# Altium schematic sheet interface.SchDoc
size A4
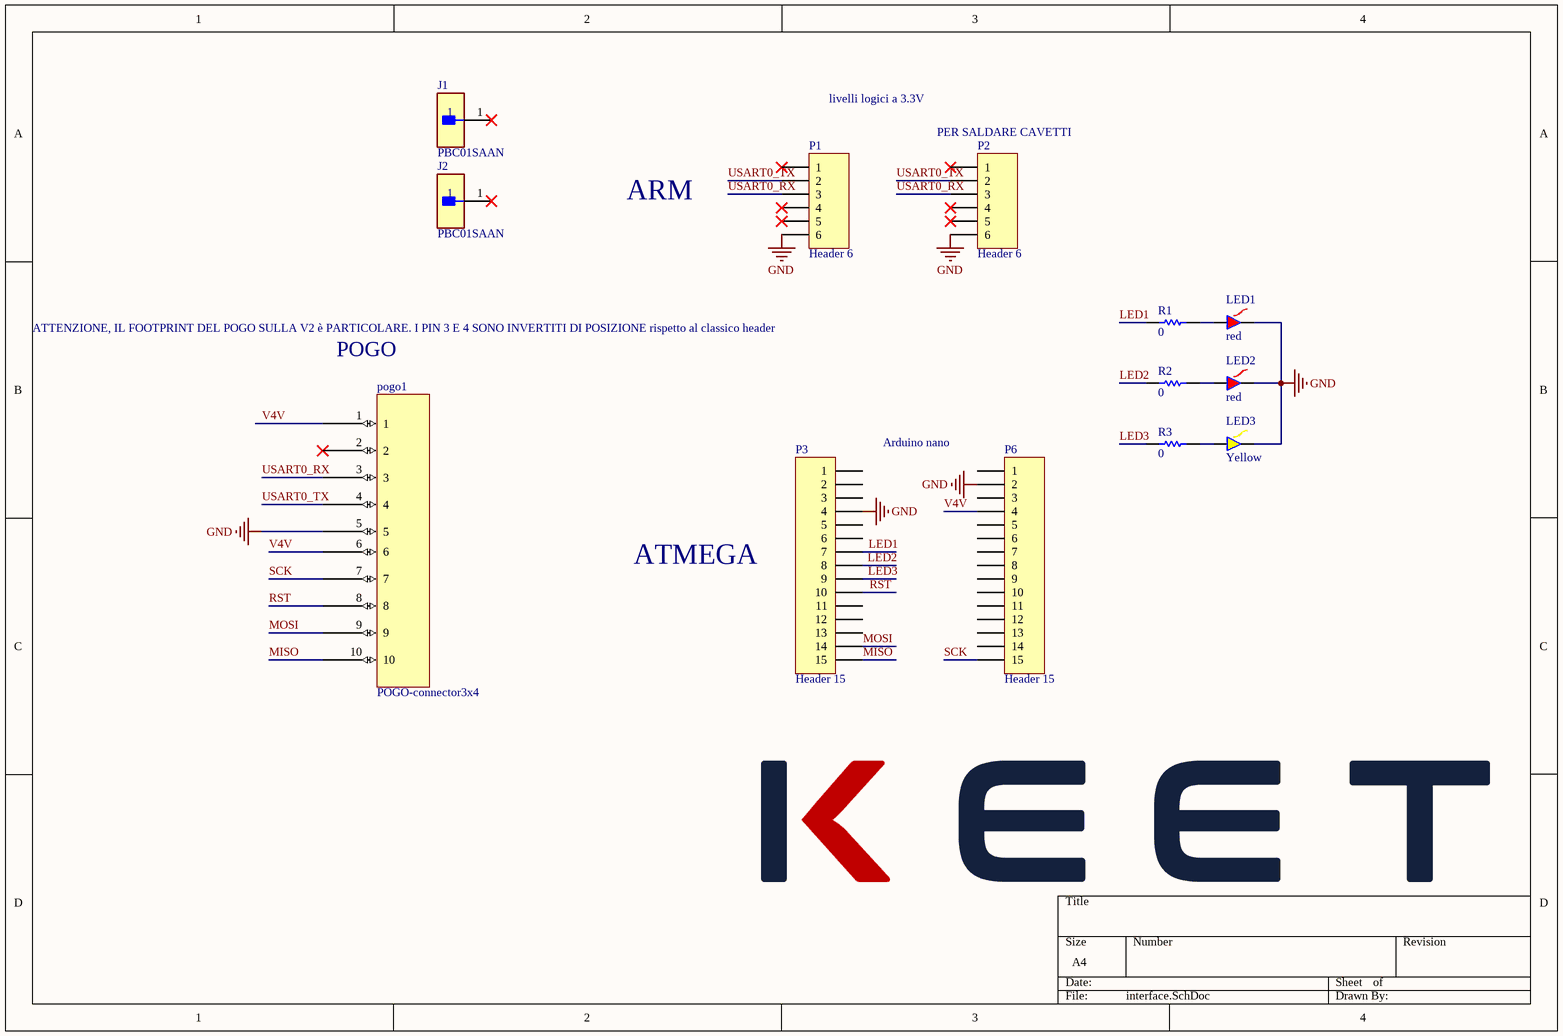
[diagram p0: interface.SchDoc]

## Parts
J1  PBC01SAAN  [FP-PBC01SAAN-MFG]
J2  PBC01SAAN  [FP-PBC01SAAN-MFG]
LED1  red  [CAC-0P80X160-2N_ver2]
LED2  red  [CAC-0P80X160-2N_ver2]
LED3  Yellow  [CAC-0P80X160-2N_ver2]
P1  Header 6  [HDR1X6]
P2  Header 6  [HDR1X6]
P3  Header 15  [HDR1X15]
P6  Header 15  [HDR1X15]
pogo1  POGO-connector3x4  [POGO_fisico]
R1  0  [RESC1608X04N]
R2  0  [RESC1608X04N]
R3  0  [RESC1608X04N]

## Nets
GND: LED1.1(K) LED2.1(K) LED3.1(K) P1.6 P2.6 P3.4 P6.2 pogo1.5
LED1: P3.7 R1.1
LED2: P3.8 R2.1
LED3: P3.9 R3.1
MISO: P3.15 pogo1.10
MOSI: P3.14 pogo1.9
RST: P3.10 pogo1.8
SCK: P6.15 pogo1.7
USART0_RX: P1.3 P2.3 pogo1.3
USART0_TX: P1.2 P2.2 pogo1.4
V4V: P6.4 pogo1.1 pogo1.6
NetLED1_2: LED1.2(A) R1.2
NetLED2_2: LED2.2(A) R2.2
NetLED3_2: LED3.2(A) R3.2

Not connected (* = marked no-connect by the designer): J1 1*; J2 1*; P1 1* 4* 5*; P2 1* 4* 5*; P3 1 2 3 5 6 11 12 13; P6 1 3 5 6 7 8 9 10 11 12 13 14; pogo1 2*

## Notes on the sheet
- livelli logici a 3.3V
- (near P2) PER SALDARE CAVETTI
- ARM
- ATTENZIONE, IL FOOTPRINT DEL POGO SULLA V2 è PARTICOLARE. I PIN 3 E 4 SONO INVERTITI DI POSIZIONE rispetto al classico header
- POGO
- Arduino nano
- ATMEGA

## Library data of the parts
J1 J2 = CMP-25680-000032-1: CONN HEADER VERT 1POS; Number of Positions: 1; Connector Type: Male Pin; Gender: Male; Pitch: 2.54mm; Contact Material: Bronze; Mount: Through Hole; Length: 2.54mm; Height: 2.54mm; Lead Free: Lead Free; Number of Rows: 1; Contact Plating: Gold; Number of Contacts: 1; Housing Material: Plastic; Termination: Solder; Package Quantity: 1; Packaging: Bulk; Color: Black; Contact Mating Length: 0.23inch; Housing Color: Black; Width: 2.54mm
LED1 LED2 = HSMS-C190: AVAGO TECHNOLOGIES - HSMS-C190 - LED, RED, 10MCD, 626NM; Manufacturer: Broadcom Avago; Lens Color: White; Forward Voltage: 2.1V; Viewing Angle: 170°; Lens Style: Diffused,Colorless,Rectangular; Forward Current: 20mA; Lens Transparency: Diffused; Power Dissipation: 52mW; Number of Elements: 1; Reverse Voltage: 5V; Supplier 1: Mouser; Manufacturer Part Number: HSMS-C190; RoHS: Yes; Category: LEDs; Stock 1: 51818; Pricing 1: 1=0,41000, 10=0,28800, 50=0,28800, 100=0,12800, 1000=0,09400, 10000=0,06400 (USD); Mount: Surface Mount; Case/Package: 0603; Number of Pins: 2; Color: Red; Case Code (Metric): 1608; Case Code (Imperial): 0603; Min Operating Temperature: -40°C; Max Operating Temperature: 85°C; Luminous Intensity: 10mcd; Packaging: Tape and Reel; Wavelength: 626nm; Dominant Wavelength: 626nm; Test Current: 20mA; Package Quantity: 4000; Illumination Color: Red; Power Rating: 52mW; Number of LEDs: 1; Series: -; Length: 1.6mm; Width: 0.8mm; Height: 0.8mm; Depth: 0.8mm; Radiation Hardening: No; REACH SVHC: No SVHC; Lead Free: Lead Free; RoHS Compliant: Yes; Supplier Part Number 1: 630-HSMS-C190
LED3 = HSMY-C190: LED, YELLOW, 8MCD, 586NM; LED Colour:Yellow; Bulb Size:-; Wavelength Typ:586nm; Forward Voltage:2.1V; Forward Current If:20mA; Luminous Intensity:8mcd; LED Mounting:SMD; Lens Shape:Rectangular; Viewing Angle:170 ; Packaging:Cut Tape;;RoHS Compliant: Yes; Manufacturer: Broadcom Avago; Lens Color: White; Number of Terminals/Pins: 2; Lens Style: Rectangular,Untinted,Diffused,Colorless; Forward Voltage: 2.1V; Viewing Angle: 170°; Forward Current: 20mA; Lens Transparency: Diffused; Power Dissipation: 52mW; Number of Elements: 1; Reverse Voltage: 5V; Supplier 1: Mouser; Manufacturer Part Number: HSMY-C190; RoHS: Yes; Category: LEDs; Stock 1: 44023; Pricing 1: 1=0,41000, 10=0,28800, 50=0,28800, 100=0,12800, 1000=0,09400, 10000=0,06400 (USD); Mount: Surface Mount; Case/Package: 0603; Number of Pins: 2; Color: Yellow; Case Code (Metric): 1608; Case Code (Imperial): 0603; Shape: Rectangular; Contact Plating: Gold; Min Operating Temperature: -40°C; Max Operating Temperature: 85°C; Luminous Intensity: 8mcd; Wavelength: 586nm; Packaging: Tape and Reel; Dominant Wavelength: 586nm; Test Current: 20mA; Package Quantity: 1; Illumination Color: Yellow; Power Rating: 52mW; Max Power Dissipation: 52mW; Number of LEDs: 1; Series: -; Length: 1.6mm; Width: 0.8mm; Height: 0.8mm; Depth: 0.8mm; Radiation Hardening: No; REACH SVHC: No SVHC; Lead Free: Lead Free; RoHS Compliant: Yes; ComponentLink1URL: https://datasheet.ciiva.com/34302/1557097-34302483.pdf?src-supplier=Jameco; ComponentLink1Description: https://datasheet.ciiva.com/34302/1557097-34302483.pdf?src-supplier=Jameco; ComponentLink2URL: https://datasheet.ciiva.com/15117/getdatasheetpartid-118294-15117593.pdf?src-supplier=Verical; ComponentLink2Description: https://datasheet.ciiva.com/15117/getdatasheetpartid-118294-15117593.pdf?src-supplier=Verical; ComponentLink3URL: https://datasheet.ciiva.com/11774/0900766b80ad69c9-11774266.pdf?src-supplier=RSComponents; ComponentLink3Description: https://datasheet.ciiva.com/11774/0900766b80ad69c9-11774266.pdf?src-supplier=RSComponents; ComponentLink4URL: https://datasheet.ciiva.com/29280/180660-da-01-en-chip-led-hsmy-c190-gelb-29280613.pdf?src-supplier=Conrad; ComponentLink4Description: https://datasheet.ciiva.com/29280/180660-da-01-en-chip-led-hsmy-c190-gelb-29280613.pdf?src-supplier=Conrad; ComponentLink5URL: https://datasheet.ciiva.com/14172/swseriehsmx-c150toc190-e-14172172.pdf?src-supplier=Distrelec; ComponentLink5Description: https://datasheet.ciiva.com/14172/swseriehsmx-c150toc190-e-14172172.pdf?src-supplier=Distrelec; Supplier Part Number 1: 630-HSMY-C190
P1 P2 = Header 6: Header, 6-Pin; LatestRevisionDate: 17-Jul-2002; LatestRevisionNote: Re-released for DXP Platform.; Publisher: Altium Limited
P3 P6 = Header 15: Header, 15-Pin; LatestRevisionDate: 17-Jul-2002; LatestRevisionNote: Re-released for DXP Platform.; Publisher: Altium Limited
pogo1 = POGO-connector3x4: pad layout for external pogo connector; System: Connector
R1-R3 = RC0603JR-130RL: YAGEO - RC0603JR-130RL - RES, THICK FILM, 0R, 0.1W, 0603; Resistance: 0mR; Power Rating: 100mW; Voltage Rating: 50V; Tolerance: 1%; Temperature Coefficient: 200ppm/°C; Supplier 1: Mouser; Manufacturer: Yageo; Manufacturer Part Number: RC0603JR-130RL; RoHS: Yes; Category: Chip SMD Resistors; Stock 1: 5989; Pricing 1: 1=0,10000, 10=0,01500, 50=0,01500, 100=0,00500, 1000=0,00500, 10000=0,00500 (USD); Case/Package: 0603; Number of Pins: 2; Case Code (Imperial): 0603; Case Code (Metric): 1608; Contact Plating: Tin,Matte; Size Code: 0603; Min Operating Temperature: -55°C; Max Operating Temperature: 155°C; Packaging: Tape and Reel; Package Quantity: 5000; Resistor Type: Thick Film; Termination: SMD/SMT; Voltage Rating (DC): 50V; Series: RC; Construction: Rectangular; Length: 1.6mm; Width: 0.8mm; Height: 0.45mm; Depth: 0.8mm; Radiation Hardening: No; REACH SVHC: No SVHC; Military Standard: Not; Lead Free: Lead Free; RoHS Compliant: Yes; ComponentLink1URL: https://datasheet.ciiva.com/7983/443971-7983749.pdf?src-supplier=Element14; ComponentLink1Description: https://datasheet.ciiva.com/7983/443971-7983749.pdf?src-supplier=Element14; ComponentLink2URL: https://datasheet.ciiva.com/46395/443971-46395125.pdf?src-supplier=Element14; ComponentLink2Description: https://datasheet.ciiva.com/46395/443971-46395125.pdf?src-supplier=Element14; Supplier Part Number 1: 603-RC0603JR-130RL